# Altium project PCB_3U_Tester.PrjPCB
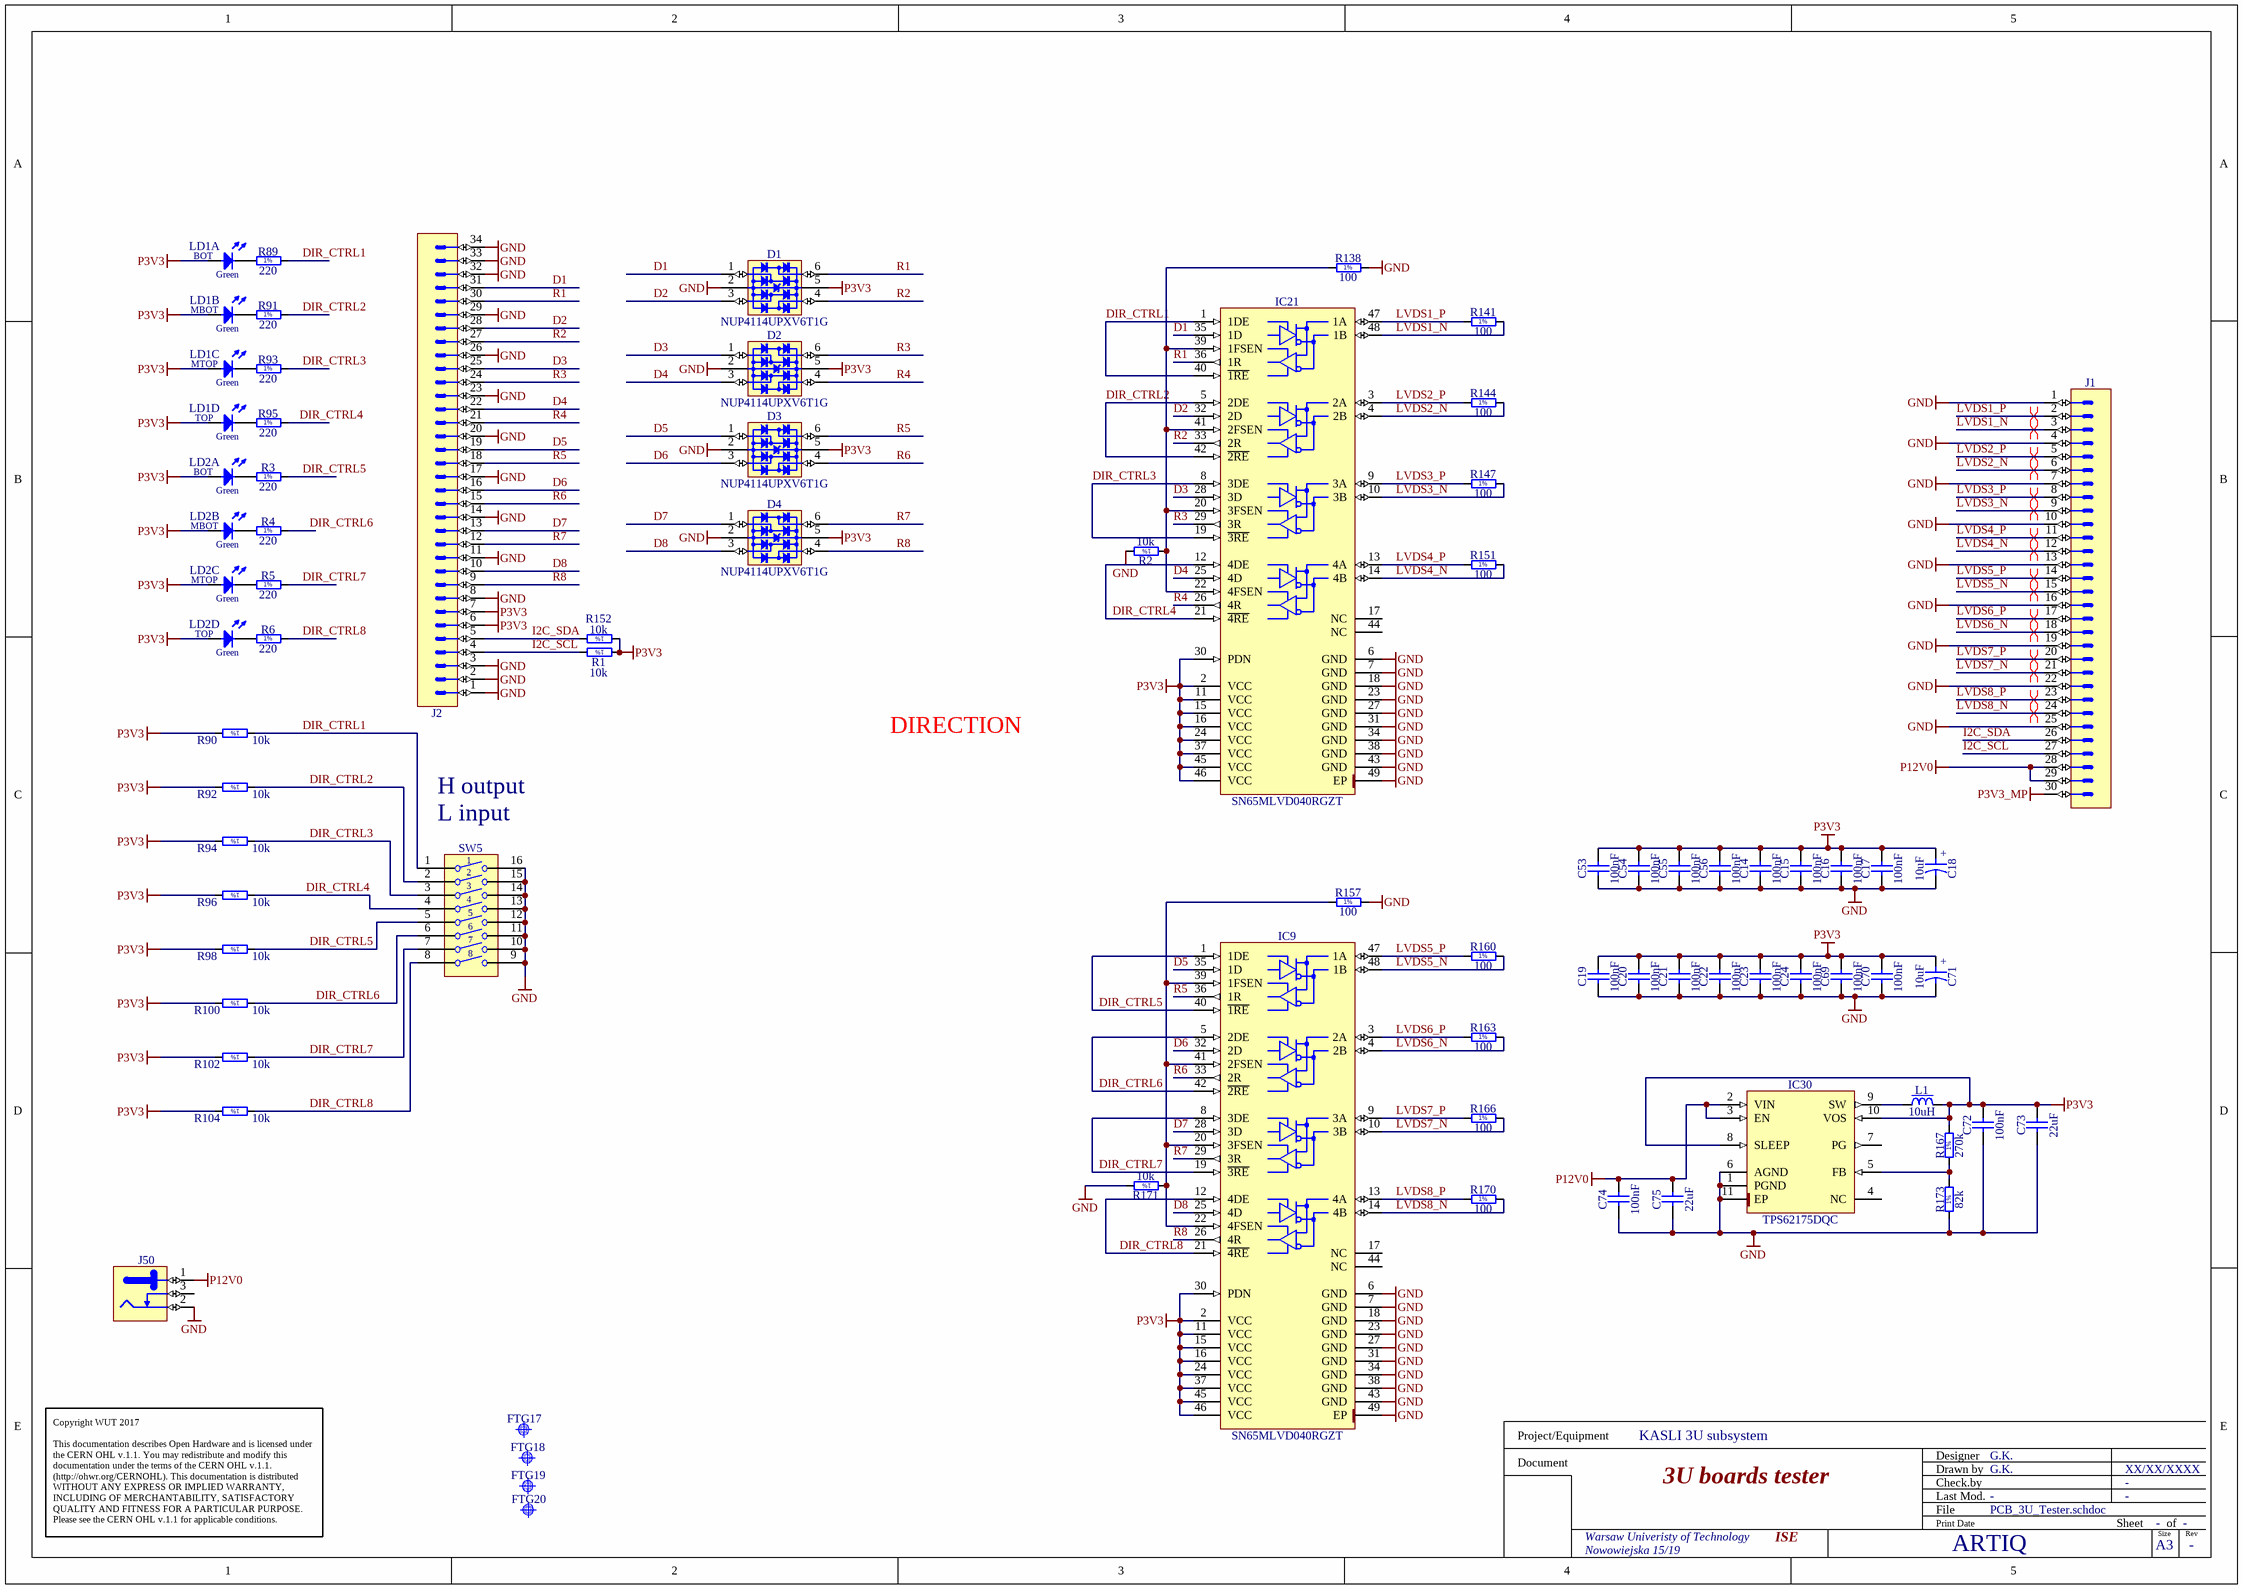
[diagram p0: PCB_3U_Tester.schdoc]
1 sheet, 72 parts. Net scope: global (net labels, ports and power ports of the same name join across sheets).
Board file: PCB_3U_Tester.PCBDOC

## Sheet PCB_3U_Tester.schdoc: 3U boards tester
size 420 x 297 mm; Author: G.K.; CompanyName: WUT; DrawnBy: G.K.; Organization: CERN; Address1: Warsaw Univeristy of Technology; Address2: Nowowiejska 15/19; Revision: -; SheetNumber: -; SheetTotal: -; EDA_Number: ARTIQ; Projet: KASLI 3U subsystem; ModifiedBy: -; CreateDate: XX/XX/XXXX; CheckedDate: -; DivGrp: ISE; Designer: G.K.; ModifiedDate: -; ProjectName: 3U boards tester

### Parts
C14  100nF  [CAPC1005X55N]
C15  100nF  [CAPC1005X55N]
C16  100nF  [CAPC1005X55N]
C17  100nF  [CAPC1005X55N]
C18  10uF  [CAPAE430X540N]
C19  100nF  [CAPC1005X55N]
C20  100nF  [CAPC1005X55N]
C21  100nF  [CAPC1005X55N]
C22  100nF  [CAPC1005X55N]
C23  100nF  [CAPC1005X55N]
C24  100nF  [CAPC1005X55N]
C53  100nF  [CAPC1005X55N]
C54  100nF  [CAPC1005X55N]
C55  100nF  [CAPC1005X55N]
C56  100nF  [CAPC1005X55N]
C69  100nF  [CAPC1005X55N]
C70  100nF  [CAPC1005X55N]
C71  10uF  [CAPAE430X540N]
C72  100nF  [CAPC1005X55N]
C73  22uF  [CAPC2012X135N]
C74  100nF  [CAPC1005X55N]
C75  22uF  [CAPC2012X135N]
D1  NUP4114UPXV6T1G  [SOTFL50P160X60-6N]
D2  NUP4114UPXV6T1G  [SOTFL50P160X60-6N]
D3  NUP4114UPXV6T1G  [SOTFL50P160X60-6N]
D4  NUP4114UPXV6T1G  [SOTFL50P160X60-6N]
FTG17  Use only in PCB  [FIDUCIAL_TOP_C100-200]  (value not drawn)
FTG18  Use only in PCB  [FIDUCIAL_TOP_S100-200]  (value not drawn)
FTG19  Use only in PCB  [FIDUCIAL_TOP_S200-400]  (value not drawn)
FTG20  Use only in PCB  [FIDUCIAL_TOP_S100-200]  (value not drawn)
IC9  SN65MLVD040RGZT  [QFN50P700X700X100-49N-S420]
IC21  SN65MLVD040RGZT  [QFN50P700X700X100-49N-S420]
IC30  TPS62175DQC  [SON50P200X300X80-11N-R94X250]
J1  (no value)  [3M_N2530-6002RB]
J2  Header 34  [3M_N2534-5002RB]  (value not drawn)
J50  Jack  [CUI_PJ-102BH]  (value not drawn)
L1  10uH  [IND_MURATA-PS_8400]
LD1  Green  [LED_BIVAR_H485CGDL]  (value not drawn)  (parts A,B,C,D of 4)
LD2  Green  [LED_BIVAR_H485CGDL]  (value not drawn)  (parts A,B,C,D of 4)
R1  10k  [RESC1005X40N]
R2  10k  [RESC1005X40N]
R3  220  [RESC1608X55N]
R4  220  [RESC1608X55N]
R5  220  [RESC1608X55N]
R6  220  [RESC1608X55N]
R89  220  [RESC1608X55N]
R90  10k  [RESC1005X40N]
R91  220  [RESC1608X55N]
R92  10k  [RESC1005X40N]
R93  220  [RESC1608X55N]
R94  10k  [RESC1005X40N]
R95  220  [RESC1608X55N]
R96  10k  [RESC1005X40N]
R98  10k  [RESC1005X40N]
R100  10k  [RESC1005X40N]
R102  10k  [RESC1005X40N]
R104  10k  [RESC1005X40N]
R138  100  [RESC1005X40N]
R141  100  [RESC1005X40N]
R144  100  [RESC1005X40N]
R147  100  [RESC1005X40N]
R151  100  [RESC1005X40N]
R152  10k  [RESC1005X40N]
R157  100  [RESC1005X40N]
R160  100  [RESC1005X40N]
R163  100  [RESC1005X40N]
R166  100  [RESC1005X40N]
R167  270k  [RESC1608X55N]
R170  100  [RESC1005X40N]
R171  10k  [RESC1005X40N]
R173  82k  [RESC1608X55N]
SW5  Switch  [SW_TYCO_1-1571983-0]  (value not drawn)

### Nets
GND: C14.1 C15.1 C16.1 C17.1 C18.2 C19.1 C20.1 C21.1 C22.1 C23.1 C24.1 C53.1 C54.1 C55.1 C56.1 C69.1 C70.1 C71.2 C72.1 C73.1 C74.1 C75.1 D1.2(GND) D2.2(GND) D3.2(GND) D4.2(GND) IC9.6(GND) IC9.7(GND) IC9.18(GND) IC9.23(GND) IC9.27(GND) IC9.31(GND) IC9.34(GND) IC9.38(GND) IC9.43(GND) IC9.49(EP) IC21.6(GND) IC21.7(GND) IC21.18(GND) IC21.23(GND) IC21.27(GND) IC21.31(GND) IC21.34(GND) IC21.38(GND) IC21.43(GND) IC21.49(EP) IC30.1(PGND) IC30.6(AGND) IC30.11(EP) J1.1 J1.4 J1.7 J1.10 J1.13 J1.16 J1.19 J1.22 J1.25 J2.1 J2.2 J2.3 J2.8 J2.11 J2.14 J2.17 J2.20 J2.23 J2.26 J2.29 J2.32 J2.33 J2.34 J50.2 R2.2 R138.2 R157.2 R171.2 R173.1 SW5.9 SW5.10 SW5.11 SW5.12 SW5.13 SW5.14 SW5.15 SW5.16
P3V3: C14.2 C15.2 C16.2 C17.2 C18.1 C19.2 C20.2 C21.2 C22.2 C23.2 C24.2 C53.2 C54.2 C55.2 C56.2 C69.2 C70.2 C71.1 C72.2 C73.2 D1.5(VBUS) D2.5(VBUS) D3.5(VBUS) D4.5(VBUS) IC9.2(VCC) IC9.11(VCC) IC9.15(VCC) IC9.16(VCC) IC9.24(VCC) IC9.30(PDN) IC9.37(VCC) IC9.45(VCC) IC9.46(VCC) IC21.2(VCC) IC21.11(VCC) IC21.15(VCC) IC21.16(VCC) IC21.24(VCC) IC21.30(PDN) IC21.37(VCC) IC21.45(VCC) IC21.46(VCC) IC30.8(SLEEP) IC30.10(VOS) J2.6 J2.7 L1.2 LD1.2(A) LD1.4(A) LD1.6(A) LD1.8(A) LD2.2(A) LD2.4(A) LD2.6(A) LD2.8(A) R1.1 R90.2 R92.2 R94.2 R96.2 R98.2 R100.2 R102.2 R104.2 R152.1 R167.2
P3V3_MP: J1.30
P12V0: C74.2 C75.2 IC30.2(VIN) IC30.3(EN) J1.28 J1.29 J50.1
D1: D1.1(I/O1) IC21.35(1D) J2.31
D2: D1.3(I/O2) IC21.32(2D) J2.28
D3: D2.1(I/O1) IC21.28(3D) J2.25
D4: D2.3(I/O2) IC21.25(4D) J2.22
D5: D3.1(I/O1) IC9.35(1D) J2.19
D6: D3.3(I/O2) IC9.32(2D) J2.16
D7: D4.1(I/O1) IC9.28(3D) J2.13
D8: D4.3(I/O2) IC9.25(4D) J2.10
DIR_CTRL1: IC21.1(1DE) IC21.40(~{1RE}) R89.2 R90.1 SW5.1
DIR_CTRL2: IC21.5(2DE) IC21.42(~{2RE}) R91.2 R92.1 SW5.2
DIR_CTRL3: IC21.8(3DE) IC21.19(~{3RE}) R93.2 R94.1 SW5.3
DIR_CTRL4: IC21.12(4DE) IC21.21(~{4RE}) R95.2 R96.1 SW5.4
DIR_CTRL5: IC9.1(1DE) IC9.40(~{1RE}) R3.2 R98.1 SW5.5
DIR_CTRL6: IC9.5(2DE) IC9.42(~{2RE}) R4.2 R100.1 SW5.6
DIR_CTRL7: IC9.8(3DE) IC9.19(~{3RE}) R5.2 R102.1 SW5.7
DIR_CTRL8: IC9.12(4DE) IC9.21(~{4RE}) R6.2 R104.1 SW5.8
I2C_SCL: J1.27 J2.4 R1.2
I2C_SDA: J1.26 J2.5 R152.2
LVDS1_N: IC21.48(1B) J1.3 R141.2
LVDS1_P: IC21.47(1A) J1.2 R141.1
LVDS2_N: IC21.4(2B) J1.6 R144.2
LVDS2_P: IC21.3(2A) J1.5 R144.1
LVDS3_N: IC21.10(3B) J1.9 R147.2
LVDS3_P: IC21.9(3A) J1.8 R147.1
LVDS4_N: IC21.14(4B) J1.12 R151.2
LVDS4_P: IC21.13(4A) J1.11 R151.1
LVDS5_N: IC9.48(1B) J1.15 R160.2
LVDS5_P: IC9.47(1A) J1.14 R160.1
LVDS6_N: IC9.4(2B) J1.18 R163.2
LVDS6_P: IC9.3(2A) J1.17 R163.1
LVDS7_N: IC9.10(3B) J1.21 R166.2
LVDS7_P: IC9.9(3A) J1.20 R166.1
LVDS8_N: IC9.14(4B) J1.24 R170.2
LVDS8_P: IC9.13(4A) J1.23 R170.1
R1: D1.6(I/O4) IC21.36(1R) J2.30
R2: D1.4(I/O3) IC21.33(2R) J2.27
R3: D2.6(I/O4) IC21.29(3R) J2.24
R4: D2.4(I/O3) IC21.26(4R) J2.21
R5: D3.6(I/O4) IC9.36(1R) J2.18
R6: D3.4(I/O3) IC9.33(2R) J2.15
R7: D4.6(I/O4) IC9.29(3R) J2.12
R8: D4.4(I/O3) IC9.26(4R) J2.9
NetIC9_20: IC9.20(3FSEN) IC9.22(4FSEN) IC9.39(1FSEN) IC9.41(2FSEN) R157.1 R171.1
NetIC21_20: IC21.20(3FSEN) IC21.22(4FSEN) IC21.39(1FSEN) IC21.41(2FSEN) R2.1 R138.1
NetIC30_5: IC30.5(FB) R167.1 R173.2
NetIC30_9: IC30.9(SW) L1.1
NetLD1_1: LD1.1(C) R89.1
NetLD1_3: LD1.3(C) R91.1
NetLD1_5: LD1.5(C) R93.1
NetLD1_7: LD1.7(C) R95.1
NetLD2_1: LD2.1(C) R3.1
NetLD2_3: LD2.3(C) R4.1
NetLD2_5: LD2.5(C) R5.1
NetLD2_7: LD2.7(C) R6.1

Not connected (* = marked no-connect by the designer): IC9 17(NC) 44(NC); IC21 17(NC) 44(NC); IC30 4(NC) 7(PG); J50 3

### Layout directives
differential pair: LVDS1_N, LVDS1_P, LVDS2_N, LVDS2_P, LVDS3_N, LVDS3_P, LVDS4_N, LVDS4_P, LVDS5_N, LVDS5_P, LVDS6_N, LVDS6_P, LVDS7_N, LVDS7_P, LVDS8_N, LVDS8_P

### Notes on the sheet
- H output
- DIRECTION
- (near SW5) L input
- Copyright WUT 2017
  This documentation describes Open Hardware and is licensed under the CERN OHL v.1.1. You may redistribute and modify this documentation under the terms of the CERN OHL v.1.1. (http://ohwr.org/CERNOHL). This documentation is distributed WITHOUT ANY EXPRESS OR IMPLIED WARRANTY, INCLUDING OF MERCHANTABILITY, SATISFACTORY QUALITY AND FITNESS FOR A PARTICULAR PURPOSE. Please see the CERN OHL v.1.1 for applicable conditions.
- Project/Equipment
- Document
- Designer
- Drawn by
- Check.by
- File
- Last Mod.
- Print Date
- Sheet
- Size
- A3
- of
- Rev
- (in symbol CAE430-540_10UF_16V_20%) +
- (in symbol LED_BIVAR_H485CGDL, part A) BOT
- (in symbol LED_BIVAR_H485CGDL, part B) MBOT
- (in symbol LED_BIVAR_H485CGDL, part C) MTOP
- (in symbol LED_BIVAR_H485CGDL, part D) TOP
- (in symbol R0402_10K_1%_0.0625W_100PPM) 1%
- (in symbol R0402_100R_1%_0.1W_100PPM) 1%
- (in symbol R0603_82K_1%_0.1W_100PPM) 1%
- (in symbol R0603_220R_1%_0.1W_100PPM) 1%
- (in symbol R0603_270K_1%_0.1W_100PPM) 1%

### Library data of the parts
C14-C17 C19-C24 C53-C56 C69 C70 C72 C74 = CC0402_100NF_16V_10%_X5R: Non-polarised capacitor; Part Description: SMD Multilayer Chip Ceramic Capacitor; Manufacturer: GENERIC; Manufacturer1 Part Number: GRM155R61C104KA88D; Voltage: 16V; TC: X5R; Tolerance: ±10%; Part Number: CC0402_100NF_16V_10%_X5R; Component Kind: Standard; Component Type: Standard; Pin Count: 2; Value: 100nF; Status: None; Manufacturer Part Number: CC0402_100NF_16V_10%_X5R; Case: 0402; Mounted: Yes; Socket: No; SMD: Yes; Sense: No; Manufacturer1 Example: MURATA; Manufacturer1 ComponentHeight: 0.55mm; HelpURL: \\cern.ch\dfs\Applications\Altium\Datasheets\CC0402_X5R_MURATA_GRM.pdf; Author: CERN DEM JLC; CreateDate: 10.12.2013; LatestRevisionDate: 10.12.2013
C18 C71 = CAE430-540_10UF_16V_20%: Polarised capacitor; Part Description: Aluminum Electrolytic SMT Capacitor; Manufacturer: PANASONIC; Manufacturer Part Number: EEEFK1C100AR; Voltage: 16V; Tolerance: ±20%; Part Number: CAE430-540_10UF_16V_20%; Component Kind: Standard; Component Type: Standard; Pin Count: 2; Value: 10uF; Status: Not Recommended; Case: B; Mounted: Yes; Socket: No; SMD: Yes; Sense: No; ComponentHeight: 5.8mm; HelpURL: \\cern.ch\dfs\Applications\Altium\Datasheets\CAE_PANASONIC_FK.pdf; Author: CERN DEM JLC; CreateDate: 03.12.2007; LatestRevisionDate: 05.11.2014
C73 C75 = CC0805_22UF_16V_10%_X5R: Non-polarised capacitor; Part Description: SMD Multilayer Chip Ceramic Capacitor; Manufacturer: GENERIC; Manufacturer1 Part Number: C2012X5R1C226KT; Voltage: 16V; TC: X5R; Tolerance: ±10%; Part Number: CC0805_22UF_16V_10%_X5R; Component Kind: Standard; Component Type: Standard; Pin Count: 2; Value: 22uF; Status: Preferred; Manufacturer Part Number: CC0805_22UF_16V_10%_X5R; Case: 0805; Mounted: Yes; Socket: No; SMD: Yes; Sense: No; Manufacturer1 Example: TDK; Manufacturer1 ComponentHeight: 1.35mm; HelpURL: \\cern.ch\dfs\Applications\Altium\Datasheets\CC0805_X5R_TDK_C.pdf; Author: CERN DEM JLC; CreateDate: 25.10.2012; LatestRevisionDate: 25.10.2012
D1-D4 = NUP4114UPXV6T1G: Part Description: ESD Protection Diodes Array (8kV) with Low Clamping Voltage; Manufacturer: ON SEMICONDUCTOR; Voltage: 5.5V; PressFit: No; Bonding: No; Part Number: NUP4114UPXV6T1G; Component Kind: Standard; Component Type: Standard; Device: NUP4114UPXV6T1G; PackageDescription: SOTFL (SOT666, SOT563,), 0.50mm, Pitch; 6 Pin, 1.20mm W X 1.60mm L X 0.60mm H Body, IPC Medium Density; Manufacturer Part Number: NUP4114UPXV6T1G; Pin Count: 8; Mounted: Yes; Socket: No; SMD: Yes; Sense: No; ComponentHeight: 1.75mm; HelpURL: \\cern.ch\dfs\Applications\Altium\Datasheets\NUP4114UPXV6T1G.pdf; Author: CERN DEM JLC; CreateDate: 05.12.2012; LatestRevisionDate: 05.12.2012
FTG17 = FIDUCIAL_TARGET_C100-200: Fiducial Target; Part Description: Round Fiducial Target, Top Layer, 1.0mm, Top Solder 2.0mm, Keepout =2.0mm; Mounted: No; Part Number: FIDUCIAL_TARGET_C100-200; Component Kind: Standard (No BOM); Component Type: Standard (No BOM); Pin Count: 1; Family: Fiducial; Socket: No; SMD: Yes; Sense: No; Status: None; ComponentHeight: 0mm; HelpURL: Undefined; Author: CERN DEM JLC; CreateDate: 09.02.2010; LatestRevisionDate: 04.04.2012; PackageDescription: Round Fiducial Target, Top Layer, 1.0mm, Top Solder 2.0mm, Keepout =2.0mm
FTG18 FTG20 = FIDUCIAL_TARGET_S100-200: Fiducial Target; Part Description: Square Fiducial Target, Top Layer, 1.0mm, Top Solder 2.0mm, Keepout =2.0mm; Mounted: No; Part Number: FIDUCIAL_TARGET_S100-200; Component Kind: Standard (No BOM); Component Type: Standard (No BOM); Pin Count: 1; Family: Fiducial; Socket: No; SMD: Yes; Sense: No; Status: None; ComponentHeight: 0mm; HelpURL: Undefined; Author: CERN DEM JLC; CreateDate: 09.02.2010; LatestRevisionDate: 04.04.2012; PackageDescription: Square Fiducial Target, Top Layer, 1.0mm, Top Solder 2.0mm, Keepout =2.0mm
FTG19 = FIDUCIAL_TARGET_S200-400: Fiducial Target; Part Description: Square Fiducial Target, Top Layer, 2.0mm, Top Solder 4.0mm, Keepout =4.0mm; Mounted: No; Part Number: FIDUCIAL_TARGET_S200-400; Component Kind: Standard (No BOM); Component Type: Standard (No BOM); Pin Count: 1; Family: Fiducial; Socket: No; SMD: Yes; Sense: No; Status: None; ComponentHeight: 0mm; HelpURL: Undefined; Author: CERN DEM JLC; CreateDate: 02.06.2008; LatestRevisionDate: 04.04.2012; PackageDescription: Square Fiducial Target, Top Layer, 2.0mm, Top Solder 4.0mm, Keepout =4.0mm
IC9 IC21 = SN65MLVD040RGZT: 4-Channel Half-Duplex M-LVDS Line Transceiver; Manufacturer: TEXAS INSTRUMENTS; PressFit: No; Bonding: No; Part Number: SN65MLVD040RGZT; Component Kind: Standard; Component Type: Standard; Device: SN65MLVD040RGZT; PackageDescription: QFN, 0.50mm Pitch, Square; 48 Pin, 7.00mm L X 7.00mm W X 1mm H body (W/Thermal Tab 4.2mm X 4.2mm), IPC Medium Density; Part Description: 4-Channel Half-Duplex M-LVDS Line Transceiver; Manufacturer Part Number: SN65MLVD040RGZT; Pin Count: 49; Case: QFN48; Mounted: Yes; Socket: No; SMD: Yes; Sense: No; ComponentHeight: 1mm; Author: CERN DEM JLC; HelpURL: \\cern.ch\dfs\Applications\Altium\Datasheets\SN65MLVD040RGZT.pdf; CreateDate: 17.03.2011; LatestRevisionDate: 17.03.2011
IC30 = TPS62175DQC: 4.75-28VDC to 1-6VDC, 500mA Step-Down Converter With Sleep Mode; Manufacturer: TEXAS INSTRUMENTS; PressFit: No; Bonding: No; Part Number: TPS62175DQC; Component Kind: Standard; Component Type: Standard; Device: TPS62175DQC; PackageDescription: SON, 10-Leads, Body 2x3mm, Pitch 0.5mm, Thermal Pad 0.94x2.5mm, IPC Medium Density; Part Description: 4.75-28VDC to 1-6VDC, 500mA Step-Down Converter With Sleep Mode; Manufacturer Part Number: TPS62175DQC; Pin Count: 11; Case: SON10; Mounted: Yes; Socket: No; SMD: Yes; Sense: No; ComponentHeight: 0.8mm; HelpURL: \\cern.ch\dfs\Applications\Altium\Datasheets\TPS62175DQC.pdf; Author: CERN DEM JMW; CreateDate: 11.08.2015; LatestRevisionDate: 11.08.2015
J1 = 3M_N2530-6002RB: Connector 30 Male; Part Description: 30 Contacts - Straight .100'' x .100'' Low Profile Four-Wall Header, 2500 Series; Manufacturer: 3M; PressFit: No; Part Number: 3M_N2530-6002RB; Component Kind: Standard; Component Type: Standard; Pin Count: 30; Family: Header 30; Mounted: Yes; Socket: No; SMD: No; Sense: No; Status: None; Manufacturer Part Number: N2530-6002RB; ComponentHeight: 10.03mm; HelpURL: \\cern.ch\dfs\Applications\Altium\Datasheets\3M_N2530-6002RB.pdf; Author: CERN DEM JLC; CreateDate: 11.02.2009; LatestRevisionDate: 11.08.2009
J2 = 3M_N2534-5002RB: Connector 34 Male; Part Description: 34 Contacts - Right Angle .100" x .100" Low Profile Four-Wall Header, 2500 Series; Manufacturer: 3M; PressFit: No; Part Number: 3M_N2534-5002RB; Component Kind: Standard; Component Type: Standard; Pin Count: 34; Family: Header 34; Mounted: Yes; Socket: No; SMD: No; Sense: No; Status: None; Manufacturer Part Number: N2534-5002RB; ComponentHeight: 8.59mm; HelpURL: \\cern.ch\dfs\Applications\Altium\Datasheets\3M_N2534-5002RB.pdf; Author: CERN DEM JLC; CreateDate: 29.10.2008; LatestRevisionDate: 11.08.2009
J50 = CUI_PJ-102BH: 2.5 mm Center Pin, 5A, 24V Right Angle, Through Hole, Tapered Pins, DC Power Jack Connector; Part Description: 2.5 mm Center Pin, 5A, 24V, Right Angle, Through Hole, Tapered Pins, DC Power Jack Connector; Manufacturer: CUI INC.; PressFit: No; Part Number: CUI_PJ-102BH; Component Kind: Standard; Component Type: Standard; Pin Count: 3; Family: Jack; Mounted: Yes; Socket: No; SMD: No; Sense: No; Status: None; Manufacturer Part Number: PJ-102BH; ComponentHeight: 11mm; HelpURL: \\cern.ch\dfs\Applications\Altium\Datasheets\CUI_PJ-102BH.pdf; Author: CERN DEM JLC; CreateDate: 14.08.2013; LatestRevisionDate: 14.08.2013
L1 = IND_10UH_10%_MURATA-PS_8400: Inductor With Core; Part Description: Miniature Surface Mount Power Inductor (8400 Serie); Manufacturer: MURATA POWER SOLUTIONS; Manufacturer Part Number: 84103C; Power: 950mA; Resistance: 0.24R; Tolerance: ±10%; Part Number: IND_10UH_10%_MURATA-PS_8400; Component Kind: Standard; Component Type: Standard; Pin Count: 2; Value: 10uH; Status: None; Mounted: Yes; Socket: No; SMD: Yes; Sense: No; ComponentHeight: 2.9mm; HelpURL: \\cern.ch\dfs\Applications\Altium\Datasheets\IND_MURATA-PS_8400.pdf; Author: CERN DEM JLC; CreateDate: 02.07.2012; LatestRevisionDate: 02.07.2012
LD1 LD2 = LED_BIVAR_H485CGDL: LED x4 Green 1C2A-BOT_3C4A_5C6A_7C8A-TOP; Part Description: Quad-Level 2mm Green LED, PCB Edge Mounting; Manufacturer: BIVAR; PressFit: No; Bonding: No; Part Number: LED_BIVAR_H485CGDL; Component Kind: Standard; Component Type: Standard; Color: Green; PackageDescription: Quad-Level 2mm Green, PCB Edge Mounting  BIVAR H485CHDL; Manufacturer Part Number: H485CGDL; Pin Count: 8; Mounted: Yes; Socket: No; SMD: No; Sense: No; ComponentHeight: 11.3mm; HelpURL: \\cern.ch\dfs\Applications\Altium\Datasheets\LED_BIVAR_H485CGDL.pdf; Author: CERN DEM JLC; CreateDate: 04.06.2012; LatestRevisionDate: 04.06.2012
R1 R2 R90 R92 R94 R96 R98 R100 R102 R104 R152 R171 = R0402_10K_1%_0.0625W_100PPM: Resistor - 1%; Part Description: General Purpose Thick Film Chip Resistor; Manufacturer: GENERIC; Manufacturer1 Part Number: 232270671003L; TC: ±100ppm/°C; Part Number: R0402_10K_1%_0.0625W_100PPM; Component Kind: Standard; Component Type: Standard; Pin Count: 2; Value: 10k; Status: Not recommended; Power: 0.0625W; Tolerance: ±1%; Manufacturer Part Number: R0402_10K_1%_0.0625W_100PPM; Case: 0402; Mounted: Yes; Sense: No; Socket: No; SMD: Yes; Manufacturer1 Example: YAGEO PHYCOMP; Manufacturer1 ComponentHeight: 0.4mm; HelpURL: \\cern.ch\dfs\Applications\Altium\Datasheets\R0402_Phycomp_RC0402.pdf; Author: CERN DEM JLC; CreateDate: 03.12.2007; LatestRevisionDate: 17.10.2012
R3-R6 R89 R91 R93 R95 = R0603_220R_1%_0.1W_100PPM: Resistor - 1%; Part Description: General Purpose Thick Film Chip Resistor; Manufacturer: GENERIC; Manufacturer1 Part Number: NRC06F2200TRF; Power: 0.1W; TC: ±100ppm/°C; Part Number: R0603_220R_1%_0.1W_100PPM; Component Kind: Standard; Component Type: Standard; Pin Count: 2; Value: 220; Status: Preferred; Tolerance: ±1%; Manufacturer Part Number: R0603_220R_1%_0.1W_100PPM; Case: 0603; Mounted: Yes; Sense: No; Socket: No; SMD: Yes; Manufacturer1 Example: NIC COMPONENT; Manufacturer1 ComponentHeight: 0.55mm; HelpURL: \\cern.ch\dfs\Applications\Altium\Datasheets\R0603_NIC_NRC.pdf; Author: CERN DEM JLC; CreateDate: 03.12.2007; LatestRevisionDate: 13.03.2008
R138 R141 R144 R147 R151 R157 R160 R163 R166 R170 = R0402_100R_1%_0.1W_100PPM: Resistor - 1%; Part Description: General Purpose Thick Film Chip Resistor; Manufacturer: GENERIC; Manufacturer Part Number: R0402_100R_1%_0.1W_100PPM_50V; Manufacturer1 Part Number: ERJ2RKF1000X; Power: 0.1W; TC: ±100ppm/°C; Voltage: 50V; Part Number: R0402_100R_1%_0.1W_100PPM; Component Kind: Standard; Component Type: Standard; Pin Count: 2; Value: 100; Status: Not recommended; Tolerance: ±1%; Case: 0402; Mounted: Yes; Sense: No; Socket: No; SMD: Yes; Manufacturer1 Example: PANASONIC; Manufacturer1 ComponentHeight: 0.4mm; HelpURL: \\cern.ch\dfs\Applications\Altium\Datasheets\R0402_PANASONIC_ERJ2RK.pdf; Author: CERN DEM JLC; CreateDate: 12.12.2013; LatestRevisionDate: 03.03.2015
R167 = R0603_270K_1%_0.1W_100PPM: Resistor - 1%; Part Description: General Purpose Thick Film Chip Resistor; Manufacturer: GENERIC; Manufacturer1 Part Number: NRC06F2703TRF; Power: 0.1W; TC: ±100ppm/°C; Part Number: R0603_270K_1%_0.1W_100PPM; Component Kind: Standard; Component Type: Standard; Pin Count: 2; Value: 270k; Status: Preferred; Tolerance: ±1%; Manufacturer Part Number: R0603_270K_1%_0.1W_100PPM; Case: 0603; Mounted: Yes; Sense: No; Socket: No; SMD: Yes; Manufacturer1 Example: NIC COMPONENT; Manufacturer1 ComponentHeight: 0.55mm; HelpURL: \\cern.ch\dfs\Applications\Altium\Datasheets\R0603_NIC_NRC.pdf; Author: CERN DEM JLC; CreateDate: 03.12.2007; LatestRevisionDate: 13.03.2008
R173 = R0603_82K_1%_0.1W_100PPM: Resistor - 1%; Part Description: General Purpose Thick Film Chip Resistor; Manufacturer: GENERIC; Manufacturer1 Part Number: NRC06F8202TRF; Power: 0.1W; TC: ±100ppm/°C; Part Number: R0603_82K_1%_0.1W_100PPM; Component Kind: Standard; Component Type: Standard; Pin Count: 2; Value: 82k; Status: Preferred; Tolerance: ±1%; Manufacturer Part Number: R0603_82K_1%_0.1W_100PPM; Case: 0603; Mounted: Yes; Sense: No; Socket: No; SMD: Yes; Manufacturer1 Example: NIC COMPONENT; Manufacturer1 ComponentHeight: 0.55mm; HelpURL: \\cern.ch\dfs\Applications\Altium\Datasheets\R0603_NIC_NRC.pdf; Author: CERN DEM JLC; CreateDate: 03.12.2007; LatestRevisionDate: 13.03.2008
SW5 = SW_TYCO_1-1571983-0: 8 Ways SPST DIP Switch; Part Description: 8 Way SPST SMD DIP Switch, Latched, Contact Rating 0.025A 24VDC; Manufacturer: TYCO; Manufacturer Part Number: 1-1571983-0 or GDH08S04; PressFit: No; Part Number: SW_TYCO_1-1571983-0; Component Kind: Standard; Component Type: Standard; Pin Count: 16; PackageDescription: Pitch 1.27mm,  Body 11.28x6.2mm, 8 Ways SPST Surface-Mount DIP Switch,TYCO GDH Serie; Family: Switch; Mounted: Yes; Socket: No; SMD: Yes; Sense: No; Status: None; ComponentHeight: 2.31mm; HelpURL: \\cern.ch\dfs\Applications\Altium\Datasheets\SW_TYCO_1-1571983-0.pdf; Author: CERN DEM JLC; CreateDate: 08.01.2009; LatestRevisionDate: 08.01.2009